# Altium schematic sheet Sensing.SchDoc
size B; SheetNumber: 3; SheetTotal: 5
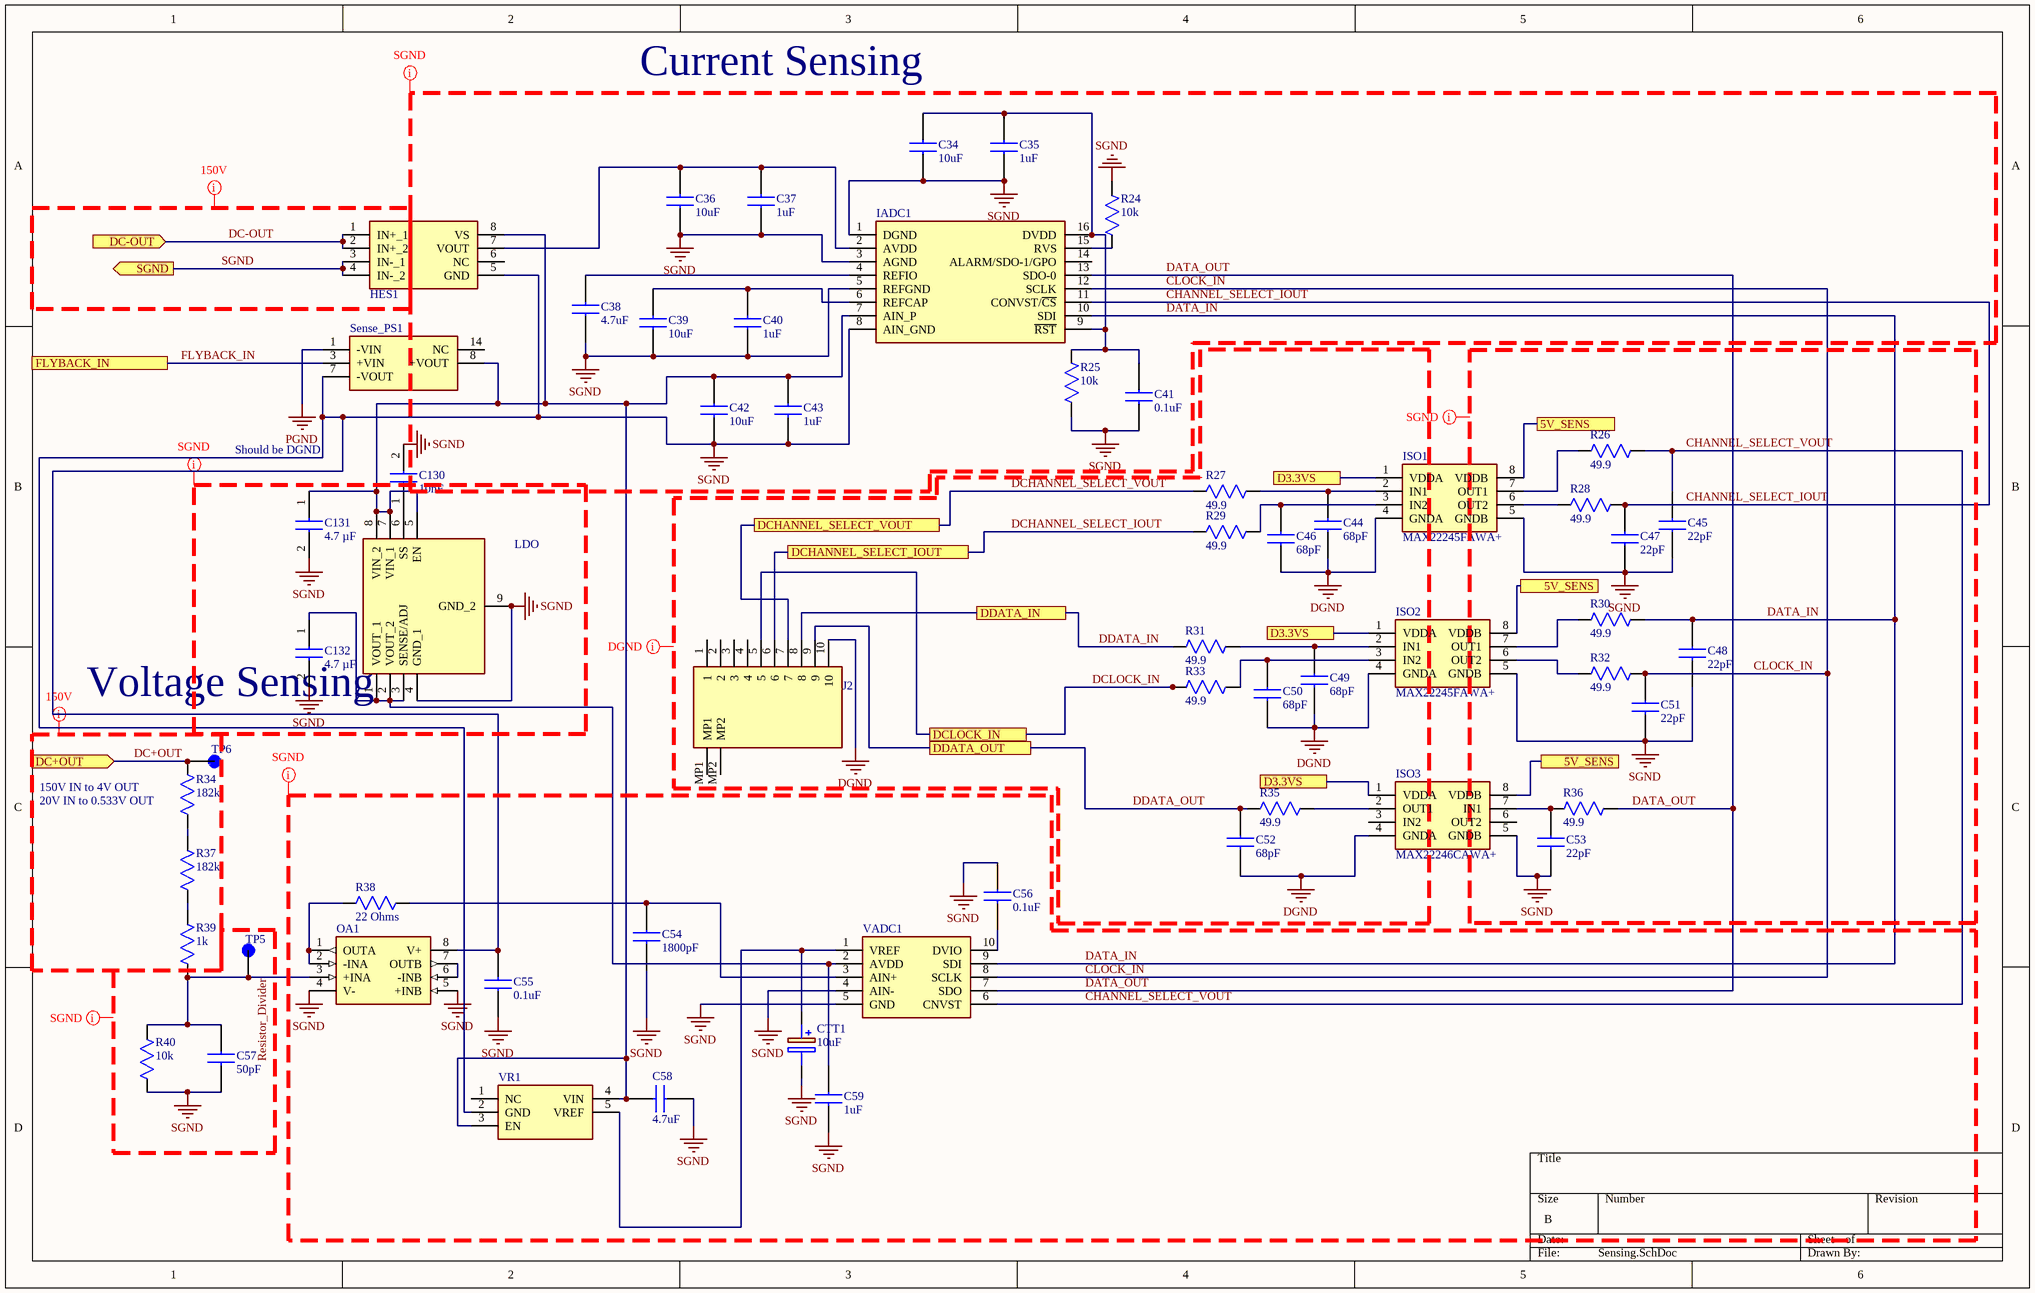
[diagram p0: Sensing.SchDoc]

## Parts
C34  10uF  [CAPC2012X140N]
C35  1uF  [CAPC2012X152N]
C36  10uF  [CAPC2012X140N]
C37  1uF  [CAPC2012X152N]
C38  4.7uF  [CAPC2012X140N]
C39  10uF  [CAPC2012X140N]
C40  1uF  [CAPC2012X152N]
C41  0.1uF  [CAPC1608X95N]
C42  10uF  [CAPC2012X140N]
C43  1uF  [CAPC2012X152N]
C44  68pF  [C0805]
C45  22pF  [C0805]
C46  68pF  [C0805]
C47  22pF  [C0805]
C48  22pF  [C0805]
C49  68pF  [C0805]
C50  68pF  [C0805]
C51  22pF  [C0805]
C52  68pF  [C0805]
C53  22pF  [C0805]
C54  1800pF  [CAPC2012X70N]
C55  0.1uF  [CAPC1608X95N]
C56  0.1uF  [CAPC1608X95N]
C57  50pF  [CAPC1608X90N]
C58  4.7uF  [CAPC2012X140N]
C59  1uF  [CAPC2012X152N]
C130  10nF  [CAPC2012X140N]
C131  4.7 µF  [CAPC2012X140N]
C132  4.7 µF  [CAPC2012X140N]
CTT1  10uF  [CAPPC2114X150N]
HES1  TMCS1107A3UQDR  [SOIC127P600X175-8N]  (value not drawn)
IADC1  ADS8681IPWR  [SOP65P640X120-16N]  (value not drawn)
ISO1  MAX22245FAWA+  [SOIC127P1031X265-8N]
ISO2  MAX22245FAWA+  [SOIC127P1031X265-8N]
ISO3  MAX22246CAWA+  [SOIC127P1031X265-8N]
J2  0545501033  [0545501033]  (value not drawn)
LDO  ADP7142ARDZ-1.8  [SOIC127P600X175-9N]  (value not drawn)
OA1  LT1498CS8#PBF  [SOIC127P599X175-8N]  (value not drawn)
R24  10k  [RESC2012X70N]
R25  10k  [RESC2012X70N]
R26  49.9  [RESC2013X84N]
R27  49.9  [RESC2013X84N]
R28  49.9  [RESC2013X84N]
R29  49.9  [RESC2013X84N]
R30  49.9  [RESC2013X84N]
R31  49.9  [RESC2013X84N]
R32  49.9  [RESC2013X84N]
R33  49.9  [RESC2013X84N]
R34  182k  [RESC3216X70N]
R35  49.9  [RESC2013X84N]
R36  49.9  [RESC2013X84N]
R37  182k  [RESC3216X70N]
R38  22 Ohms  [RESC2012X65N]
R39  1k  [RESC2012X70N]
R40  10k  [RESC2012X70N]
Sense_PS1  NXF1S0505MC-R7  [NXF1S0505MCR13]  (value not drawn)
TP5  Voltage Divider Testpoint  [TP_5011]  (value not drawn)
TP6  Test Point 5011  [TP_5011]  (value not drawn)
VADC1  MCP33131-10-E/MS  [SOP50P490X110-10N]  (value not drawn)
VR1  LM4132AMF-4.1_NOPB  [SOT95P280X145-5N]  (value not drawn)

## Ports
5V_SENS (see Sec_Gate_Driver[4C], Sensing[5B]), 5V_SENS (see Sec_Gate_Driver[4C], Sensing[5B], Sensing[5C]), D3.3VS (see Sensing[4B]), D3.3VS (see Sensing[4B], Sensing[4C]), DC+OUT (in, see Power_Board[4B], Sec_Gate_Driver[3B], Sec_Gate_Driver[6B]), DC-OUT (in, see Power_Board[6C]), DCHANNEL_SELECT_IOUT, DCHANNEL_SELECT_VOUT, DCLOCK_IN, DDATA_IN, DDATA_OUT, FLYBACK_IN (see Aux_Power[5A], Pri_Gate_Driver[1B], Pri_Gate_Driver[1C], Pri_Gate_Driver[4B], Pri_Gate_Driver[4C], Sec_Gate_Driver[1B], Sec_Gate_Driver[1C], Sec_Gate_Driver[3B], Sec_Gate_Driver[3C]), SGND (out, see Power_Board[6C])

## Nets
DGND: C44.1 C46.1 C49.1 C50.1 C52.1 ISO1.4(GNDA) ISO2.4(GNDA) ISO3.4(GNDA) J2.10
PGND: Sense_PS1.1(-VIN)
SGND: C34.1 C35.1 C36.1 C37.1 C38.1 C39.1 C40.1 C41.1 C42.1 C43.1 C45.1 C47.1 C48.1 C51.1 C53.1 C54.2 C55.1 C55.2 C56.2 C57.2 C58.1 C59.1 C130.2 C131.2 C132.2 CTT1.2(-) HES1.3(IN-_1) HES1.4(IN-_2) HES1.5(GND) IADC1.1(DGND) IADC1.3(AGND) IADC1.5(REFGND) IADC1.8(AIN_GND) ISO1.5(GNDB) ISO2.5(GNDB) ISO3.5(GNDB) LDO.4(GND_1) LDO.9(GND_2) OA1.4(V-) OA1.5(+INB) OA1.8(V+) R24.2 R25.2 R40.1 Sense_PS1.7(-VOUT) VADC1.4(AIN-) VADC1.5(GND) VR1.2(GND) ; port SGND
5V_SENS: ISO1.8(VDDB) ISO2.8(VDDB) ISO3.8(VDDB) ; port 5V_SENS
CHANNEL_SELECT_IOUT: C47.2 IADC1.11(CONVST/~{CS}) R28.2
CHANNEL_SELECT_VOUT: C45.2 R26.2 VADC1.6(CNVST)
CLOCK_IN: C51.2 IADC1.12(SCLK) R32.2 VADC1.8(SCLK)
D3.3VS: ISO1.1(VDDA) ISO2.1(VDDA) ISO3.1(VDDA) ; port D3.3VS
DATA_IN: C48.2 IADC1.10(SDI) R30.2 VADC1.9(SDI)
DATA_OUT: IADC1.13(SDO-0) R36.2 VADC1.7(SDO)
DC+OUT: R34.1 TP6.1 ; port DC+OUT
DC-OUT: HES1.1(IN+_1) HES1.2(IN+_2) ; port DC-OUT
DCHANNEL_SELECT_IOUT: J2.6 R29.1 ; port DCHANNEL_SELECT_IOUT
DCHANNEL_SELECT_VOUT: J2.7 R27.1 ; port DCHANNEL_SELECT_VOUT
DCLOCK_IN: J2.5 R33.1 ; port DCLOCK_IN
DDATA_IN: J2.8 R31.1 ; port DDATA_IN
DDATA_OUT: C52.2 J2.9 R35.1 ; port DDATA_OUT
FLYBACK_IN: Sense_PS1.3(+VIN) ; port FLYBACK_IN
Resistor_Divider: C57.1 OA1.3(+INA) R39.1 R40.2 TP5.1
NetC34_2: C34.2 C35.2 C41.2 IADC1.9(~{RST}) IADC1.16(DVDD) R25.1
NetC36_2: C36.2 C37.2 HES1.7(VOUT) IADC1.2(AVDD)
NetC38_2: C38.2 IADC1.4(REFIO)
NetC39_2: C39.2 C40.2 IADC1.6(REFCAP)
NetC42_2: C42.2 C43.2 C58.2 C131.1 HES1.8(VS) IADC1.7(AIN_P) LDO.5(EN) LDO.7(VIN_1) LDO.8(VIN_2) Sense_PS1.8(+VOUT) VR1.3(EN) VR1.4(VIN)
NetC44_2: C44.2 ISO1.2(IN1) R27.2
NetC46_2: C46.2 ISO1.3(IN2) R29.2
NetC49_2: C49.2 ISO2.2(IN1) R31.2
NetC50_2: C50.2 ISO2.3(IN2) R33.2
NetC53_2: C53.2 ISO3.7(IN1) R36.1
NetC54_1: C54.1 R38.2 VADC1.3(AIN+)
NetC56_1: C56.1 VADC1.10(DVIO)
NetC59_2: C59.2 C132.1 LDO.1(VOUT_1) LDO.2(VOUT_2) LDO.3(SENSE/ADJ) VADC1.2(AVDD)
NetC130_1: C130.1 LDO.6(SS)
NetCTT1_1: CTT1.1(+) VADC1.1(VREF) VR1.5(VREF)
NetIADC1_15: IADC1.15(RVS) R24.1
NetISO1_6: ISO1.6(OUT2) R28.1
NetISO1_7: ISO1.7(OUT1) R26.1
NetISO2_6: ISO2.6(OUT2) R32.1
NetISO2_7: ISO2.7(OUT1) R30.1
NetISO3_2: ISO3.2(OUT1) R35.2
NetOA1_1: OA1.1(OUTA) OA1.2(-INA) R38.1
NetOA1_6: OA1.6(-INB) OA1.7(OUTB)
NetR34_2: R34.2 R37.2
NetR37_1: R37.1 R39.2

Not connected (* = marked no-connect by the designer): HES1 6(NC); IADC1 14(ALARM/SDO-1/GPO); ISO3 3(IN2) 6(OUT2); J2 1 2 3 4 MP1 MP2; Sense_PS1 14(NC); VR1 1(NC)

## Layout directives
net class SGND: CHANNEL_SELECT_IOUT, CHANNEL_SELECT_VOUT, CLOCK_IN, DATA_IN, DATA_OUT, Resistor_Divider, SGND
net class 150V: DC+OUT, DC-OUT, SGND
net class DGND: DCHANNEL_SELECT_IOUT, DCHANNEL_SELECT_VOUT, DCLOCK_IN, DDATA_IN, DDATA_OUT, DGND

## Notes on the sheet
- Current Sensing
- Should be DGND
- Voltage Sensing
- 150V IN to 4V OUT
- (near R34) 20V IN to 0.533V OUT

## Library data of the parts
C34 C36 C39 C42 = CL21B106KPQNNNE: Capacitor; Manufacturer_Name: SAMSUNG; Datasheet Link: https://datasheet.datasheetarchive.com/originals/distributors/Datasheets_SAMA/4587f8cda595dcaeb94190dec8e1001d.pdf; Height: 1.4mm; Manufacturer_Part_Number: CL21B106KPQNNNE; Mouser Part Number: 187-CL21B106KPQNNNE; Mouser Price/Stock: https://www.mouser.co.uk/ProductDetail/Samsung-Electro-Mechanics/CL21B106KPQNNNE?qs=yOVawPpwOwnw0R5uMCgpNQ%3D%3D; Arrow Part Number: CL21B106KPQNNNE; Arrow Price/Stock: https://www.arrow.com/en/products/cl21b106kpqnnne/samsung-electro-mechanics?utm_currency=USD&region=europe
C35 C37 C40 C43 C59 = 0805ZC105KAT2A: Capacitor; Manufacturer_Name: Kyocera AVX; Datasheet Link: http://datasheets.avx.com/X7RDielectric.pdf; Height: 1.52mm; Manufacturer_Part_Number: 0805ZC105KAT2A; Mouser Part Number: 581-0805ZC105K; Mouser Price/Stock: https://www.mouser.co.uk/ProductDetail/KYOCERA-AVX/0805ZC105KAT2A?qs=xgF8L8qeT4CdIRVv939gnA%3D%3D; Arrow Part Number: 0805ZC105KAT2A; Arrow Price/Stock: https://www.arrow.com/en/products/0805zc105kat2a/avx?region=nac
C38 C58 = GCM21BC71A475KA73L: Capacitor; Manufacturer_Name: Murata Electronics; Datasheet Link: https://search.murata.co.jp/Ceramy/image/img/A01X/G101/ENG/GCM21BC71A475KA73-01A.pdf; Height: 1.4mm; Manufacturer_Part_Number: GCM21BC71A475KA73L; Mouser Part Number: 81-GCM21BC71A475KA3L; Mouser Price/Stock: https://www.mouser.com/Search/Refine.aspx?Keyword=81-GCM21BC71A475KA3L; Arrow Part Number: GCM21BC71A475KA73L; Arrow Price/Stock: https://www.arrow.com/en/products/gcm21bc71a475ka73l/murata-manufacturing
C41 C55 C56 = C0603C104K5RACTU7042: Capacitor; Manufacturer_Name: KEMET; Datasheet Link: https://www.arrow.com/en/products/c0603c104k5ractu7042/kemet-corporation; Height: 0.95mm; Manufacturer_Part_Number: C0603C104K5RACTU7042; Arrow Part Number: C0603C104K5RACTU7042; Arrow Price/Stock: https://www.arrow.com/en/products/c0603c104k5ractu7042/kemet-corporation
C44 C46 C49 C50 C52 = C0805C680J5GACTU: CAP CER 68PF 50V C0G/NP0 0805; Manufacturer_Name: KEMET; Datasheet Link: https://content.kemet.com/datasheets/KEM_C1003_C0G_SMD.pdf; Height: 1.1mm; Manufacturer_Part_Number: C0805C680J5GACTU; Mouser Part Number: 80-C0805C680J5G; Mouser Price/Stock: https://www.mouser.co.uk/ProductDetail/KEMET/C0805C680J5GACTU?qs=6TVATEUodcRQxIollGm9Gg%3D%3D
C45 C47 C48 C51 C53 = C0805C220J1GACTU: CAP CER 22PF 100V C0G/NP0 0805; Manufacturer_Name: KEMET; Datasheet Link: https://content.kemet.com/datasheets/KEM_C1003_C0G_SMD.pdf; Height: 1.1mm; Manufacturer_Part_Number: C0805C220J1GACTU; Mouser Part Number: 80-C0805C220J1G; Mouser Price/Stock: https://www.mouser.co.uk/ProductDetail/KEMET/C0805C220J1GACTU?qs=43LhqrlLHAWrlSFTo8H45g%3D%3D; Arrow Part Number: C0805C220J1GACTU; Arrow Price/Stock: https://www.arrow.com/en/products/c0805c220j1gactu/kemet-corporation
C54 = GRM2165C2A182JA01D: Capacitor; Manufacturer_Name: Murata Electronics; Datasheet Link: https://search.murata.co.jp/Ceramy/image/img/A01X/G101/ENG/GRM2165C2A182JA01-01A.pdf; Height: 0.7mm; Manufacturer_Part_Number: GRM2165C2A182JA01D; Arrow Part Number: GRM2165C2A182JA01D; Arrow Price/Stock: https://www.arrow.com/en/products/grm2165c2a182ja01d/murata-manufacturing?region=nac
C57 = CC0603JRNPO9BN500: Capacitor; Manufacturer_Name: KEMET; Datasheet Link: https://mouser.componentsearchengine.com/Datasheets/1/CC0603JRNPO9BN500.pdf; Height: 0.9mm; Manufacturer_Part_Number: CC0603JRNPO9BN500; Mouser Part Number: 603-CC0603JRNP9BN500; Mouser Price/Stock: https://www.mouser.com/Search/Refine.aspx?Keyword=603-CC0603JRNP9BN500
C130 = 885012207011: 10000 pF ±10% 10V Ceramic Capacitor X7R 0805 (2012 Metric); Manufacturer_Name: Wurth Elektronik; Datasheet Link: https://katalog.we-online.com/pbs/datasheet/885012207011.pdf; Height: 0.9mm; Manufacturer_Part_Number: 885012207011; Mouser Part Number: 710-885012207011; Mouser Price/Stock: https://www.mouser.co.uk/ProductDetail/Wurth-Elektronik/885012207011?qs=0KOYDY2FL28KyHFRGnMzJg%3D%3D
C131 C132 = GCM21BC71A475KA73L_1: 4.7 µF ±10% 10V Ceramic Capacitor X7S 0805 (2012 Metric); Manufacturer_Name: Murata Electronics; Datasheet Link: https://search.murata.co.jp/Ceramy/image/img/A01X/G101/ENG/GCM21BC71A475KA73-01A.pdf; Height: 1.4mm; Manufacturer_Part_Number: GCM21BC71A475KA73L; Mouser Part Number: 81-GCM21BC71A475KA3L; Mouser Price/Stock: https://www.mouser.com/Search/Refine.aspx?Keyword=81-GCM21BC71A475KA3L; Arrow Part Number: GCM21BC71A475KA73L; Arrow Price/Stock: https://www.arrow.com/en/products/gcm21bc71a475ka73l/murata-manufacturing
CTT1 = TLCR106M020XTA: Capacitor Polarised; Manufacturer_Name: Kyocera AVX; Datasheet Link: https://componentsearchengine.com/Datasheets/2/TLCR106M020XTA.pdf; Height: 1.5mm; Manufacturer_Part_Number: TLCR106M020XTA; Mouser Part Number: 581-TLCR106M020XTA; Mouser Price/Stock: https://www.mouser.co.uk/ProductDetail/KYOCERA-AVX/TLCR106M020XTA?qs=52kyYQljw0ezQFSNBVe80g%3D%3D
HES1 = TMCS1107A3UQDR: SENSOR CURRENT HALL EFFECT 8SOIC; Manufacturer_Name: Texas Instruments; Datasheet Link: https://www.ti.com/lit/ds/symlink/tmcs1107.pdf?ts=1632147875425&ref_url=https%253A%252F%252Fwww.ti.com%252Fproduct%252FTMCS1107; Height: 1.75mm; Manufacturer_Part_Number: TMCS1107A3UQDR; Mouser Part Number: 595-TMCS1107A3UQDR; Mouser Price/Stock: https://www.mouser.co.uk/ProductDetail/Texas-Instruments/TMCS1107A3UQDR?qs=pUKx8fyJudCBoGjIiP0sJw%3D%3D
IADC1 = ADS8681IPWR: Integrated Circuit; Manufacturer_Name: Texas Instruments; Datasheet Link: http://www.ti.com/lit/gpn/ads8681; Height: 1.2mm; Manufacturer_Part_Number: ADS8681IPWR; Mouser Part Number: 595-ADS8681IPWR; Mouser Price/Stock: https://www.mouser.co.uk/ProductDetail/Texas-Instruments/ADS8681IPWR?qs=dBWc1juS%252B3xVLt67pACC0A%3D%3D; Arrow Part Number: ADS8681IPWR; Arrow Price/Stock: https://www.arrow.com/en/products/ads8681ipwr/texas-instruments?utm_currency=USD&region=europe
ISO1 ISO2 = MAX22245FAWA+: DG ISO 5KV 2CH CAN/RS232 8-SOIC; Manufacturer_Name: Analog Devices; Datasheet Link: https://datasheets.maximintegrated.com/en/ds/MAX22245-MAX22246.pdf; Height: 2.65mm; Manufacturer_Part_Number: MAX22245FAWA+
ISO3 = MAX22246CAWA+: DG ISO 5KV 2CH CAN/RS232 8-SOIC; Manufacturer_Name: Analog Devices; Datasheet Link: https://datasheets.maximintegrated.com/en/ds/MAX22245-MAX22246.pdf; Height: 2.65mm; Manufacturer_Part_Number: MAX22246CAWA+; Mouser Part Number: 700-MAX22246CAWA+; Mouser Price/Stock: https://www.mouser.co.uk/ProductDetail/Analog-Devices-Maxim-Integrated/MAX22246CAWA%2b?qs=DPoM0jnrROXVfsS9dCX1xg%3D%3D; Arrow Part Number: MAX22246CAWA+; Arrow Price/Stock: https://www.arrow.com/en/products/max22246cawa/maxim-integrated?region=nac
J2 = 0545501033: CONN FFC FPC TOP 10POS 0.5MM R/A; Manufacturer_Name: Molex; Datasheet Link: https://www.molex.com/pdm_docs/ps/PS-54550-014.pdf; Height: 1.3mm; Manufacturer_Part_Number: 0545501033; Mouser Part Number: N/A; Mouser Price/Stock: https://www.mouser.co.uk/ProductDetail/Molex/0545501033?qs=%252BdQmOuGyFcHnJeP%252B%2F8NYUA%3D%3D; Arrow Part Number: 0545501033; Arrow Price/Stock: https://www.arrow.com/en/products/0545501033/molex
LDO = ADP7142ARDZ-1.8: Integrated Circuit; Manufacturer_Name: Analog Devices; Datasheet Link: https://www.analog.com/ADP7142/datasheet; Height: 1.75mm; Manufacturer_Part_Number: ADP7142ARDZ-1.8; Mouser Part Number: 584-ADP7142ARDZ-1.8; Mouser Price/Stock: https://www.mouser.co.uk/ProductDetail/Analog-Devices/ADP7142ARDZ-1.8?qs=hpwIUhX6lWx4wbdO4ei1bw%3D%3D; Arrow Part Number: ADP7142ARDZ-1.8; Arrow Price/Stock: null?region=nac
OA1 = LT1498CS8#PBF: Integrated Circuit; Manufacturer_Name: Analog Devices; Datasheet Link: http://cds.linear.com/docs/en/datasheet/14989fg.pdf; Height: 1.752mm; Manufacturer_Part_Number: LT1498CS8#PBF; Mouser Part Number: 584-LT1498CS8#PBF; Mouser Price/Stock: https://www.mouser.co.uk/ProductDetail/Analog-Devices/LT1498CS8PBF?qs=ytflclh7QUXektDKdlkqaw%3D%3D; Arrow Part Number: LT1498CS8#PBF; Arrow Price/Stock: https://www.arrow.com/en/products/lt1498cs8pbf/linear-technology
R24 R25 R40 = ERJ-PB6B1002V: Resistor; Manufacturer_Name: Panasonic; Datasheet Link: https://componentsearchengine.com/Datasheets/1/ERJ-PB6B1002V.pdf; Height: 0.7mm; Manufacturer_Part_Number: ERJ-PB6B1002V; Mouser Part Number: 667-ERJ-PB6B1002V; Mouser Price/Stock: https://www.mouser.co.uk/ProductDetail/Panasonic/ERJ-PB6B1002V?qs=eFOtW6xYNWFfvuWzLzq%2FIQ%3D%3D; Arrow Part Number: ERJ-PB6B1002V; Arrow Price/Stock: https://www.arrow.com/en/products/erj-pb6b1002v/panasonic?region=nac
R26-R33 R35 R36 = PCAN0805E49R9BST5: RES SMD 49.9 OHM 0.1% 1W 0805; Manufacturer_Name: Vishay; Datasheet Link: https://altium.componentsearchengine.com/Datasheets/1/PCAN0805E49R9BST5.pdf; Height: 0.838mm; Manufacturer_Part_Number: PCAN0805E49R9BST5; Mouser Part Number: 71-PCAN0805E49R9BST5; Mouser Price/Stock: https://www.mouser.co.uk/ProductDetail/Vishay-Thin-Film/PCAN0805E49R9BST5?qs=0KABoAvMNWeDPZ7%2F3japZQ%3D%3D
R34 R37 = ERA-8AEB1823V: Resistor; Manufacturer_Name: Panasonic; Datasheet Link: https://industrial.panasonic.com/cdbs/www-data/pdf/RDM0000/AOA0000C307.pdf; Height: 0.7mm; Manufacturer_Part_Number: ERA-8AEB1823V
R38 = CPF-A-0805B22RE1: Resistor; Manufacturer_Name: TE Connectivity; Datasheet Link: https://www.te.com/commerce/DocumentDelivery/DDEController?Action=srchrtrv&DocNm=1773200-1&DocType=Data%20Sheet&DocLang=English&PartCntxt=2176217-7&DocFormat=pdf; Height: 0.65mm; Manufacturer_Part_Number: CPF-A-0805B22RE1; Mouser Part Number: 279-CPF-A-0805B22RE1; Mouser Price/Stock: https://www.mouser.com/Search/Refine.aspx?Keyword=279-CPF-A-0805B22RE1
R39 = ERJ-PB6B1001V: Resistor; Manufacturer_Name: Panasonic; Datasheet Link: https://www.arrow.com/en/products/erj-pb6b1001v/panasonic; Height: 0.7mm; Manufacturer_Part_Number: ERJ-PB6B1001V; Mouser Part Number: 667-ERJ-PB6B1001V; Mouser Price/Stock: https://www.mouser.co.uk/ProductDetail/Panasonic/ERJ-PB6B1001V?qs=eFOtW6xYNWE%2FWj4RAZWV2A%3D%3D; Arrow Part Number: ERJ-PB6B1001V; Arrow Price/Stock: https://www.arrow.com/en/products/erj-pb6b1001v/panasonic
Sense_PS1 = NXF1S0505MC-R7: Power Supply; Manufacturer_Name: Murata Electronics; Datasheet Link: https://media.digikey.com/pdf/Data%20Sheets/Murata%20PDFs/NXF1_Series_Ds.pdf; Height: 5mm; Manufacturer_Part_Number: NXF1S0505MC-R7; Mouser Part Number: 580-NXF1S0505MC-R7; Mouser Price/Stock: https://www.mouser.co.uk/ProductDetail/Murata-Power-Solutions/NXF1S0505MC-R7?qs=fAHHVMwC%252BbiGBb9AV9FFLQ%3D%3D; Arrow Part Number: NXF1S0505MC-R7; Arrow Price/Stock: https://www.arrow.com/en/products/nxf1s0505mc-r7/murata-power-solutions?region=nac
TP5 TP6 = Test Point 5011: MP: altium_native_batch; Value: *; Availability: Unavailable; Price: None; Package: None
VADC1 = MCP33131-10-E_MS: Integrated Circuit; Manufacturer_Name: Microchip; Datasheet Link: http://ww1.microchip.com/downloads/en/DeviceDoc/MCP33131D-Data-Sheet-DS20005947B.pdf; Height: 1.1mm; Manufacturer_Part_Number: MCP33131-10-E/MS; Mouser Part Number: 579-MCP33131-10-E/MS; Mouser Price/Stock: https://www.mouser.co.uk/ProductDetail/Microchip-Technology/MCP33131-10-E-MS?qs=byeeYqUIh0P8g72Pz2M%252Brg%3D%3D; Arrow Part Number: MCP33131-10-E/MS; Arrow Price/Stock: https://www.arrow.com/en/products/mcp33131-10-ems/microchip-technology?utm_currency=USD&region=nac
VR1 = LM4132AMF-4.1_NOPB: Integrated Circuit; Manufacturer_Name: Texas Instruments; Manufacturer_Part_Number: LM4132AMF-4.1/NOPB; Datasheet Link: http://www.ti.com/lit/ds/symlink/lm4132.pdf; Height: 1.45mm; Mouser Part Number: 926-LM4132AMF4.1NOPB; Mouser Price/Stock: https://www.mouser.co.uk/ProductDetail/Texas-Instruments/LM4132AMF-4.1-NOPB?qs=QbsRYf82W3G952V2jwZlog%3D%3D; Arrow Part Number: LM4132AMF-4.1/NOPB; Arrow Price/Stock: https://www.arrow.com/en/products/lm4132amf-4.1nopb/texas-instruments